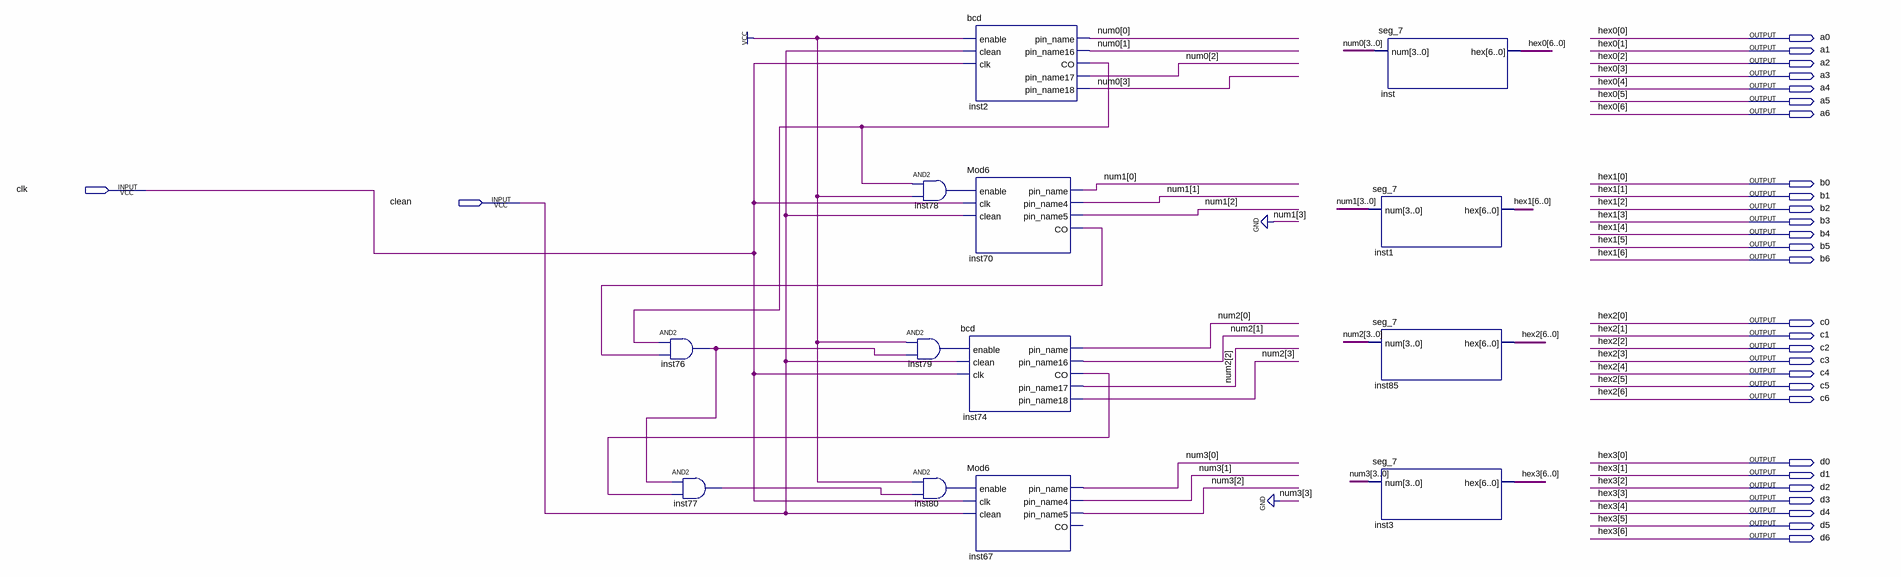
[diagram p0: schematic sheet]
// Quartus schematic Block3.bdf as structural Verilog: 13 symbols, 30 pins
module Block3 (
  input  clk,
  input  clean,
  output a0,
  output a1,
  output a2,
  output a3,
  output a4,
  output a5,
  output a6,
  output b0,
  output b1,
  output b2,
  output b3,
  output b4,
  output b5,
  output b6,
  output c0,
  output c1,
  output c2,
  output c3,
  output c4,
  output c5,
  output c6,
  output d0,
  output d1,
  output d2,
  output d3,
  output d4,
  output d5,
  output d6
);

  wire inst2_co, inst70_co, inst74_co, inst76_out, inst77_out, inst78_out, inst79_out, inst80_out;
  wire [2:0] num1, num3;
  wire [3:0] num0, num2;

  and inst76 (inst76_out, inst2_co, inst70_co);
  and inst77 (inst77_out, inst76_out, inst74_co);
  and inst78 (inst78_out, inst2_co, 1'b1);
  and inst79 (inst79_out, 1'b1, inst76_out);
  and inst80 (inst80_out, 1'b1, inst77_out);
  bcd inst2 (
    .enable(1'b1), .clean(clean), .clk(clk), .pin_name(num0[0]), .pin_name16(num0[1]), .CO(inst2_co),
    .pin_name17(num0[2]), .pin_name18(num0[3]));
  Mod6 inst70 (
    .enable(inst78_out), .clk(clk), .clean(clean), .pin_name(num1[0]), .pin_name4(num1[1]),
    .pin_name5(num1[2]), .CO(inst70_co));
  bcd inst74 (
    .enable(inst79_out), .clean(clean), .clk(clk), .pin_name(num2[0]), .pin_name16(num2[1]), .CO(inst74_co),
    .pin_name17(num2[2]), .pin_name18(num2[3]));
  Mod6 inst67 (
    .enable(inst80_out), .clk(clk), .clean(clean), .pin_name(num3[0]), .pin_name4(num3[1]),
    .pin_name5(num3[2]));  // open: CO
  seg_7 inst (.num(num0), .hex({a6, a5, a4, a3, a2, a1, a0}));
  seg_7 inst1 (.num({1'b0, num1}), .hex({b6, b5, b4, b3, b2, b1, b0}));
  seg_7 inst85 (.num(num2), .hex({c6, c5, c4, c3, c2, c1, c0}));
  seg_7 inst3 (.num({1'b0, num3}), .hex({d6, d5, d4, d3, d2, d1, d0}));

  // Other names for the same wires on the sheet: hex0[6:0] = {a6, a5, a4, a3, a2, a1, a0};
  //   hex1[6:0] = {b6, b5, b4, b3, b2, b1, b0}; hex2[6:0] = {c6, c5, c4, c3, c2, c1, c0};
  //   hex3[6:0] = {d6, d5, d4, d3, d2, d1, d0}
endmodule
